# Altium schematic sheet Microphone.SchDoc
size A4; SheetNumber: 2; SheetTotal: 3
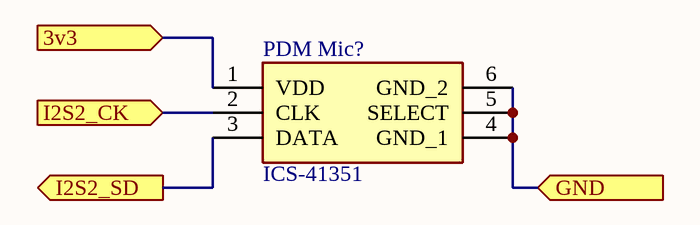
[diagram p0: Microphone.SchDoc]

## Parts
PDM_Mic?  ICS-41351  [ICS41351]

## Ports
3v3 (in), GND (in), I2S2_CK (in), I2S2_SD (out)

## Nets
3v3: PDM_Mic?.1(VDD) ; port 3v3
GND: PDM_Mic?.4(GND_1) PDM_Mic?.5(SELECT) PDM_Mic?.6(GND_2) ; port GND
I2S2_CK: PDM_Mic?.2(CLK) ; port I2S2_CK
I2S2_SD: PDM_Mic?.3(DATA) ; port I2S2_SD

## Library data of the parts
PDM_Mic? = ICS-41351: Microphone; Manufacturer_Name: TDK; Datasheet Link: https://product.tdk.com/system/files/dam/doc/product/sw_piezo/mic/mems-mic/data_sheet/ds-000157-ics-41351-v1.1.pdf; Height: 1.08mm; Manufacturer_Part_Number: ICS-41351; Mouser Part Number: 410-ICS-41351; Mouser Price/Stock: https://www.mouser.co.uk/ProductDetail/TDK-InvenSense/ICS-41351?qs=%252B6g0mu59x7LDJ1mBnROZzA%3D%3D; Arrow Part Number: ICS-41351; Arrow Price/Stock: https://www.arrow.com/en/products/ics-41351/invensense